# EAGLE design cft-memory-board (EAGLE 5.11)
DRAWN_BY: Alexios; PROJECT_NAME: CFT Mini-Computer; REVISION: Rev A; SHEET_DESCRIPTION: Memory (up to 512kW RAM, 512kW ROM); SIMULATION_FILENAME: memory.v#memory; URL: http://www.bedroomlan.org/cft

## Sheet 1 of 3
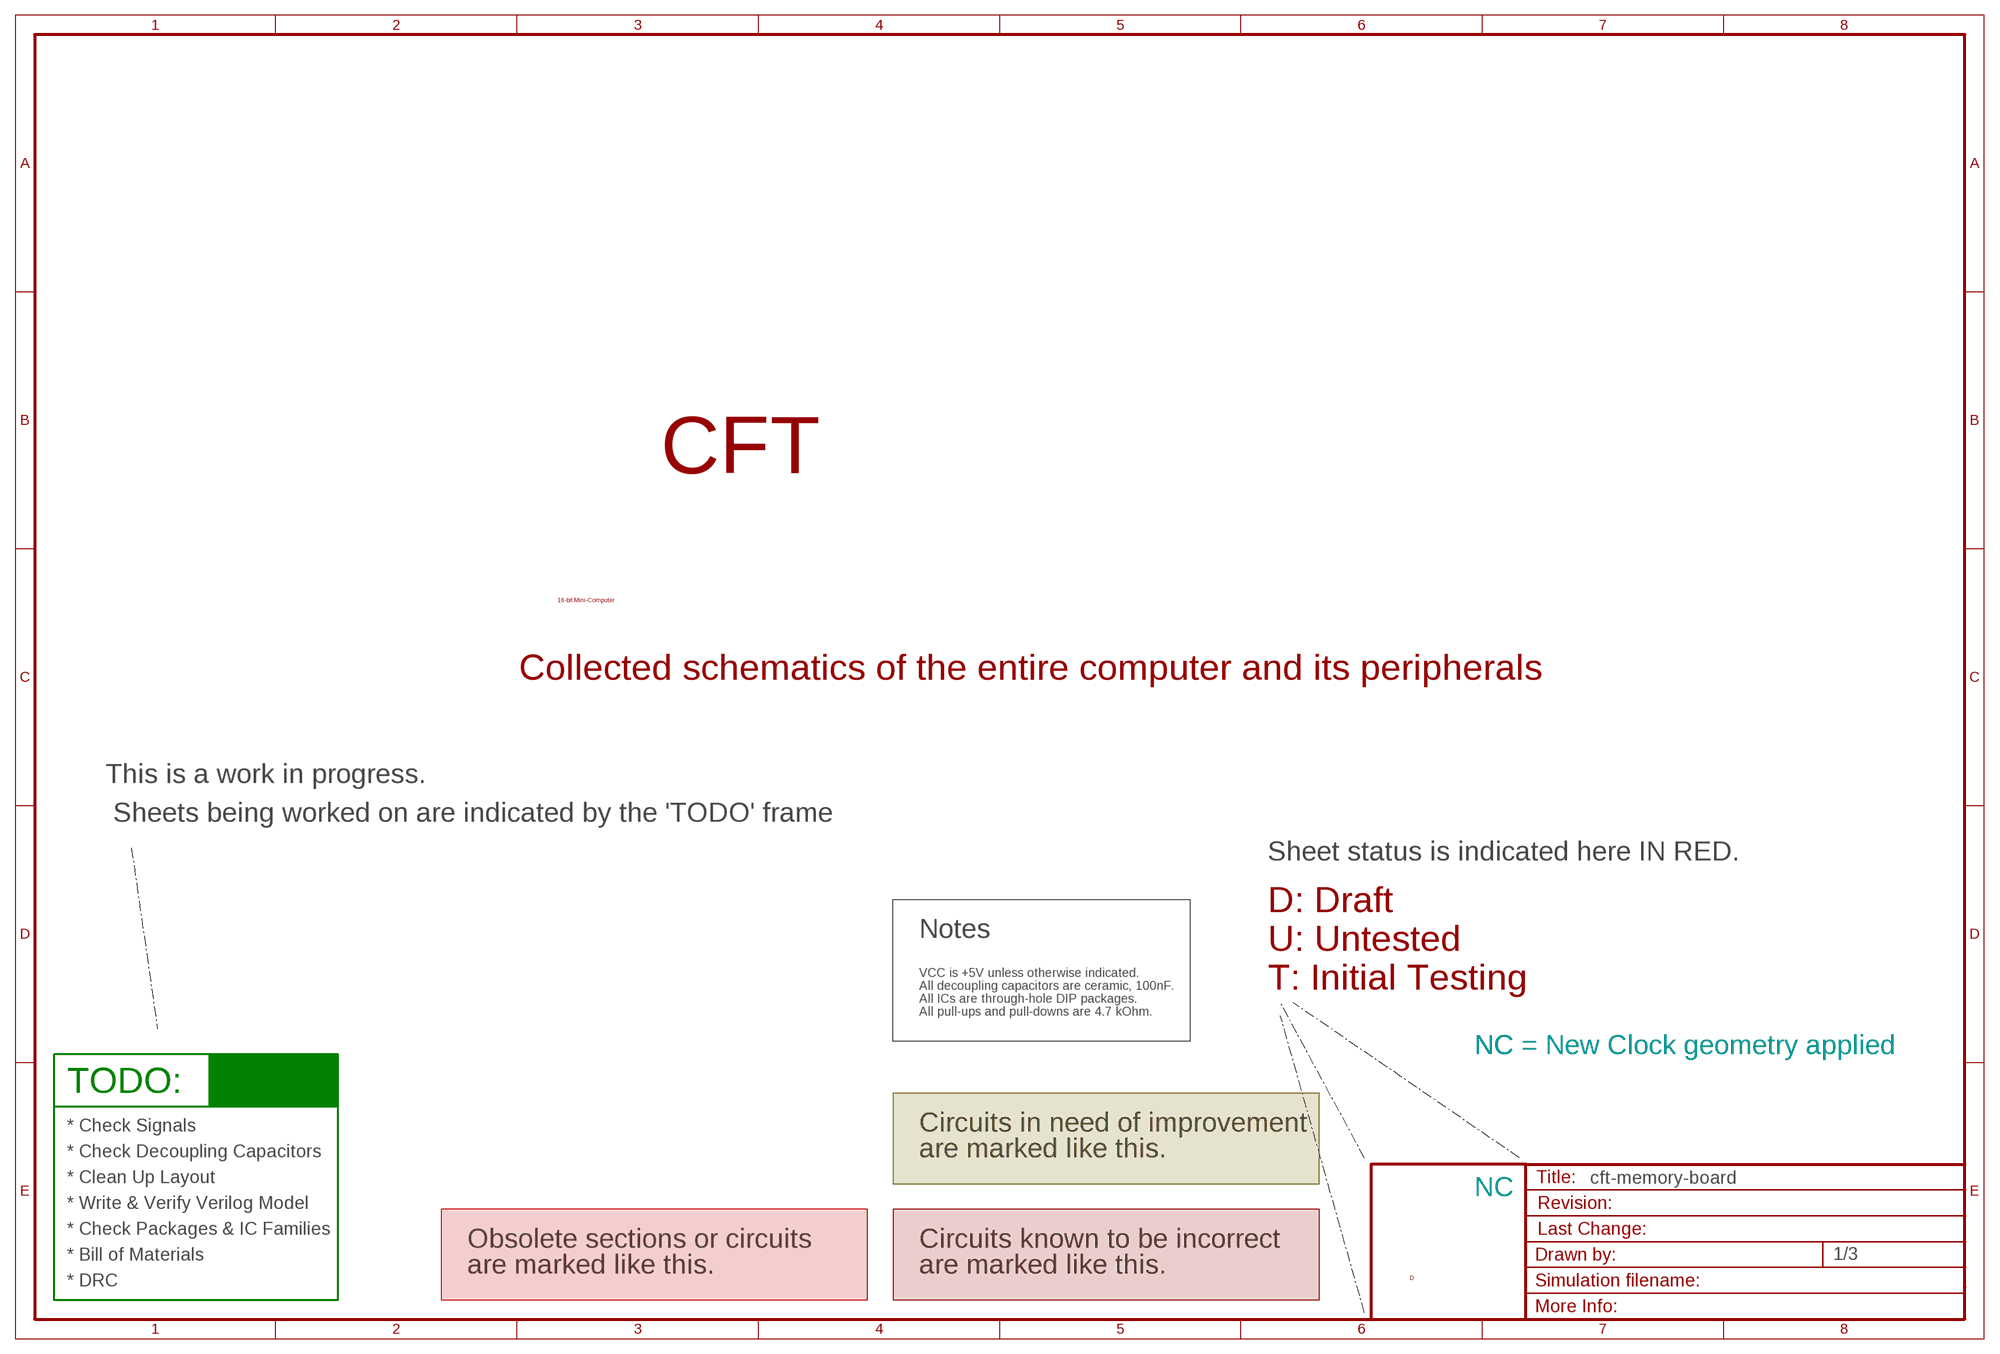
[diagram p0: schematic, sheet 1]

### Notes on the sheet
- CFT
- 16-bit Mini-Computer
- Collected schematics of the entire computer and its peripherals
- This is a work in progress.
- Sheets being worked on are indicated by the 'TODO' frame
- Sheet status is indicated here IN RED.
- D: Draft
- Notes
- U: Untested
- VCC is +5V unless otherwise indicated.
- All decoupling capacitors are ceramic, 100nF. | T: Initial Testing
- All ICs are through-hole DIP packages.
- All pull-ups and pull-downs are 4.7 kOhm.
- NC | NC = New Clock geometry applied
- TODO:
- * Check Signals | Circuits in need of improvement
- * Check Decoupling Capacitors | are marked like this.
- * Clean Up Layout
- NC
- * Write & Verify Verilog Model
- * Check Packages & IC Families
- Obsolete sections or circuits | Circuits known to be incorrect
- * Bill of Materials
- are marked like this. | are marked like this.
- D
- * DRC

## Sheet 2 of 3
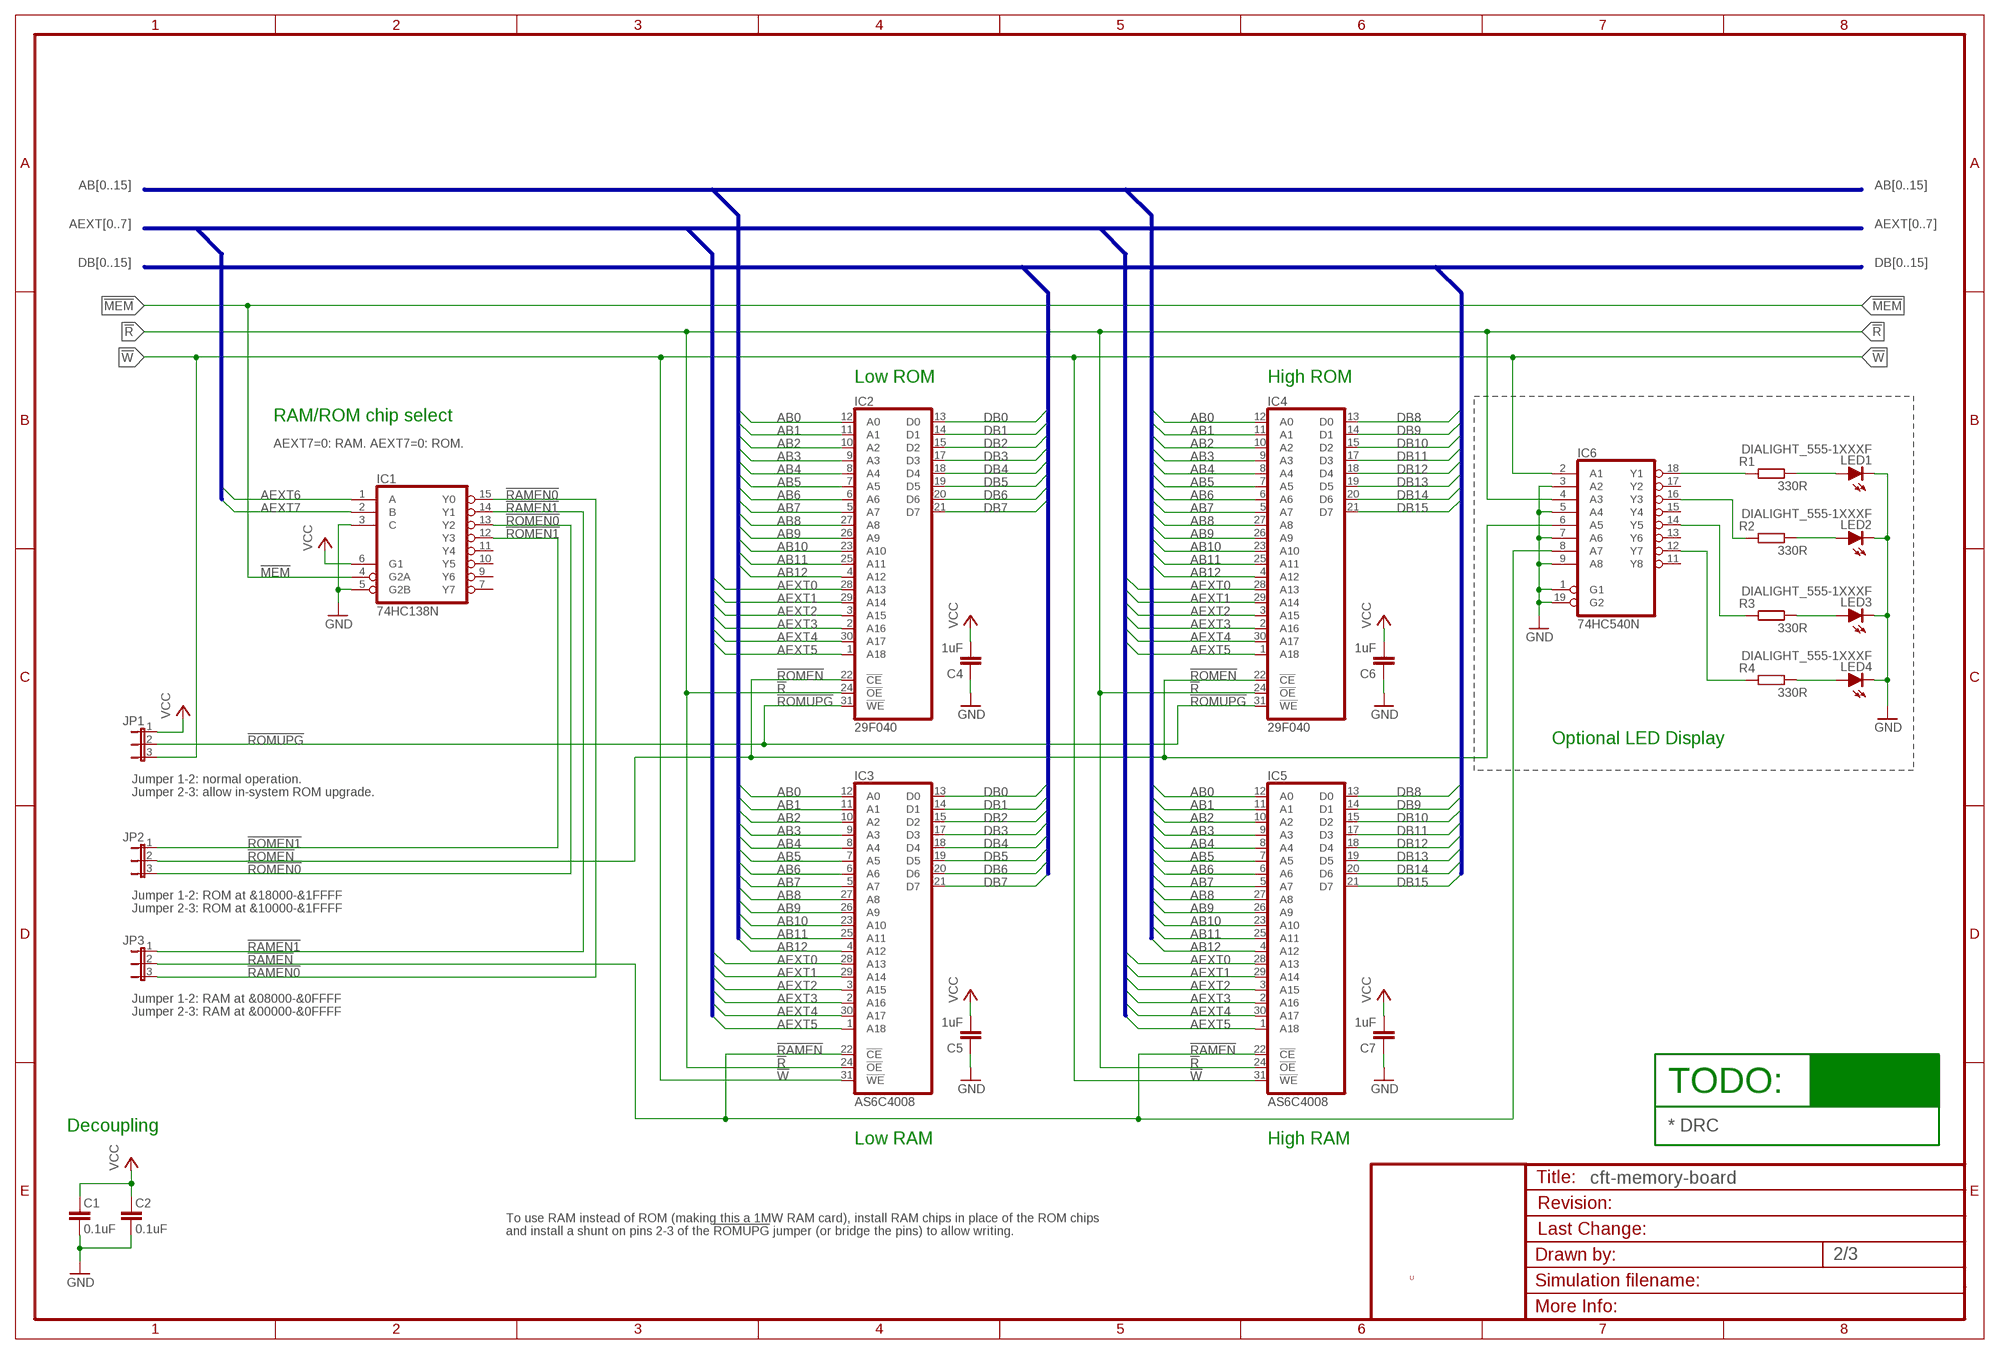
[diagram p1: schematic, sheet 2]

### Parts
C1  0.1uF  C-EU025-024X044  [C025-024X044]
C2  0.1uF  C-EU025-024X044  [C025-024X044]
C4  1uF  C-EU025-024X044  [C025-024X044]
C5  1uF  C-EU025-024X044  [C025-024X044]
C6  1uF  C-EU025-024X044  [C025-024X044]
C7  1uF  C-EU025-024X044  [C025-024X044]
IC1  74HC138N  [DIL16]
IC2  29F040  29F040PLCC32  [PLCC32]
IC3  AS6C4008  29F040DIP32  [DIL32]
IC4  29F040  29F040PLCC32  [PLCC32]
IC5  AS6C4008  29F040DIP32  [DIL32]
IC6  74HC540N  [DIL20]
JP1  JP2E  [JP2]
JP2  JP2E  [JP2]
JP3  JP2E  [JP2]
LED1  DIALIGHT_555-1XXXF  [LED_PCB2]
LED2  DIALIGHT_555-1XXXF  [LED_PCB2]
LED3  DIALIGHT_555-1XXXF  [LED_PCB2]
LED4  DIALIGHT_555-1XXXF  [LED_PCB2]
R1  330R  R-EU_0204/7  [0204/7]
R2  330R  R-EU_0204/7  [0204/7]
R3  330R  R-EU_0204/7  [0204/7]
R4  330R  R-EU_0204/7  [0204/7]

### Nets
!MEM: IC1.4(G2A) ; also sheet 3
!R: IC2.24(!OE) IC3.24(!OE) IC4.24(!OE) IC5.24(!OE) IC6.4(A3) ; also sheet 3
!RAMEN: IC3.22(!CE) IC5.22(!CE) IC6.8(A7) JP3.2
!RAMEN0: IC1.15(Y0) JP3.3
!RAMEN1: IC1.14(Y1) JP3.1
!ROMEN: IC2.22(!CE) IC4.22(!CE) IC6.6(A5) JP2.2
!ROMEN0: IC1.13(Y2) JP2.3
!ROMEN1: IC1.12(Y3) JP2.1
!ROMUPG: IC2.31(!WE) IC4.31(!WE) JP1.2
!W: IC3.31(!WE) IC5.31(!WE) IC6.2(A1) JP1.3 ; also sheet 3
AB0: IC2.12(A0) IC3.12(A0) IC4.12(A0) IC5.12(A0) ; also sheet 3
AB1: IC2.11(A1) IC3.11(A1) IC4.11(A1) IC5.11(A1) ; also sheet 3
AB2: IC2.10(A2) IC3.10(A2) IC4.10(A2) IC5.10(A2) ; also sheet 3
AB3: IC2.9(A3) IC3.9(A3) IC4.9(A3) IC5.9(A3) ; also sheet 3
AB4: IC2.8(A4) IC3.8(A4) IC4.8(A4) IC5.8(A4) ; also sheet 3
AB5: IC2.7(A5) IC3.7(A5) IC4.7(A5) IC5.7(A5) ; also sheet 3
AB6: IC2.6(A6) IC3.6(A6) IC4.6(A6) IC5.6(A6) ; also sheet 3
AB7: IC2.5(A7) IC3.5(A7) IC4.5(A7) IC5.5(A7) ; also sheet 3
AB8: IC2.27(A8) IC3.27(A8) IC4.27(A8) IC5.27(A8) ; also sheet 3
AB9: IC2.26(A9) IC3.26(A9) IC4.26(A9) IC5.26(A9) ; also sheet 3
AB10: IC2.23(A10) IC3.23(A10) IC4.23(A10) IC5.23(A10) ; also sheet 3
AB11: IC2.25(A11) IC3.25(A11) IC4.25(A11) IC5.25(A11) ; also sheet 3
AB12: IC2.4(A12) IC3.4(A12) IC4.4(A12) IC5.4(A12) ; also sheet 3
AEXT0: IC2.28(A13) IC3.28(A13) IC4.28(A13) IC5.28(A13) ; also sheet 3
AEXT1: IC2.29(A14) IC3.29(A14) IC4.29(A14) IC5.29(A14) ; also sheet 3
AEXT2: IC2.3(A15) IC3.3(A15) IC4.3(A15) IC5.3(A15) ; also sheet 3
AEXT3: IC2.2(A16) IC3.2(A16) IC4.2(A16) IC5.2(A16) ; also sheet 3
AEXT4: IC2.30(A17) IC3.30(A17) IC4.30(A17) IC5.30(A17) ; also sheet 3
AEXT5: IC2.1(A18) IC3.1(A18) IC4.1(A18) IC5.1(A18) ; also sheet 3
AEXT6: IC1.1(A) ; also sheet 3
AEXT7: IC1.2(B) ; also sheet 3
DB0: IC2.13(D0) IC3.13(D0) ; also sheet 3
DB1: IC2.14(D1) IC3.14(D1) ; also sheet 3
DB2: IC2.15(D2) IC3.15(D2) ; also sheet 3
DB3: IC2.17(D3) IC3.17(D3) ; also sheet 3
DB4: IC2.18(D4) IC3.18(D4) ; also sheet 3
DB5: IC2.19(D5) IC3.19(D5) ; also sheet 3
DB6: IC2.20(D6) IC3.20(D6) ; also sheet 3
DB7: IC2.21(D7) IC3.21(D7) ; also sheet 3
DB8: IC4.13(D0) IC5.13(D0) ; also sheet 3
DB9: IC4.14(D1) IC5.14(D1) ; also sheet 3
DB10: IC4.15(D2) IC5.15(D2) ; also sheet 3
DB11: IC4.17(D3) IC5.17(D3) ; also sheet 3
DB12: IC4.18(D4) IC5.18(D4) ; also sheet 3
DB13: IC4.19(D5) IC5.19(D5) ; also sheet 3
DB14: IC4.20(D6) IC5.20(D6) ; also sheet 3
DB15: IC4.21(D7) IC5.21(D7) ; also sheet 3
GND [low power]: C1.1 C2.1 C4.1 C5.1 C6.1 C7.1 IC1.3(C) IC1.5(G2B) IC6.1(G1) IC6.3(A2) IC6.5(A4) IC6.7(A6) IC6.9(A8) IC6.19(G2) LED1.K(C) LED2.K(C) LED3.K(C) LED4.K(C) ; also sheet 3
N$104: LED1.A R1.2
N$136: IC6.18(Y1) R1.1
N$137: LED2.A R2.2
N$138: IC6.16(Y3) R2.1
N$139: LED3.A R3.2
N$140: IC6.14(Y5) R3.1
N$141: LED4.A R4.2
N$150: IC6.12(Y7) R4.1
VCC [low power]: C1.2 C2.2 C4.2 C5.2 C6.2 C7.2 IC1.6(G1) JP1.1 ; also sheet 3
Unconnected: IC1.7(Y7) IC1.9(Y6) IC1.10(Y5) IC1.11(Y4) IC6.11(Y8) IC6.13(Y6) IC6.15(Y4) IC6.17(Y2)

### Buses
AB[0..15]
DB[0..15]
AEXT[0..7]

### Notes on the sheet
- Low ROM | High ROM
- RAM/ROM chip select
- AEXT7=0: RAM. AEXT7=0: ROM.
- Optional LED Display
- Jumper 1-2: normal operation.
- Jumper 2-3: allow in-system ROM upgrade.
- Jumper 1-2: ROM at &18000-&1FFFF
- Jumper 2-3: ROM at &10000-&1FFFF
- Jumper 1-2: RAM at &08000-&0FFFF
- Jumper 2-3: RAM at &00000-&0FFFF
- TODO:
- Decoupling | * DRC
- Low RAM | High RAM
- To use RAM instead of ROM (making this a 1MW RAM card), install RAM chips in place of the ROM chips
- and install a shunt on pins 2-3 of the !ROMUPG! jumper (or bridge the pins) to allow writing.
- U

## Sheet 3 of 3
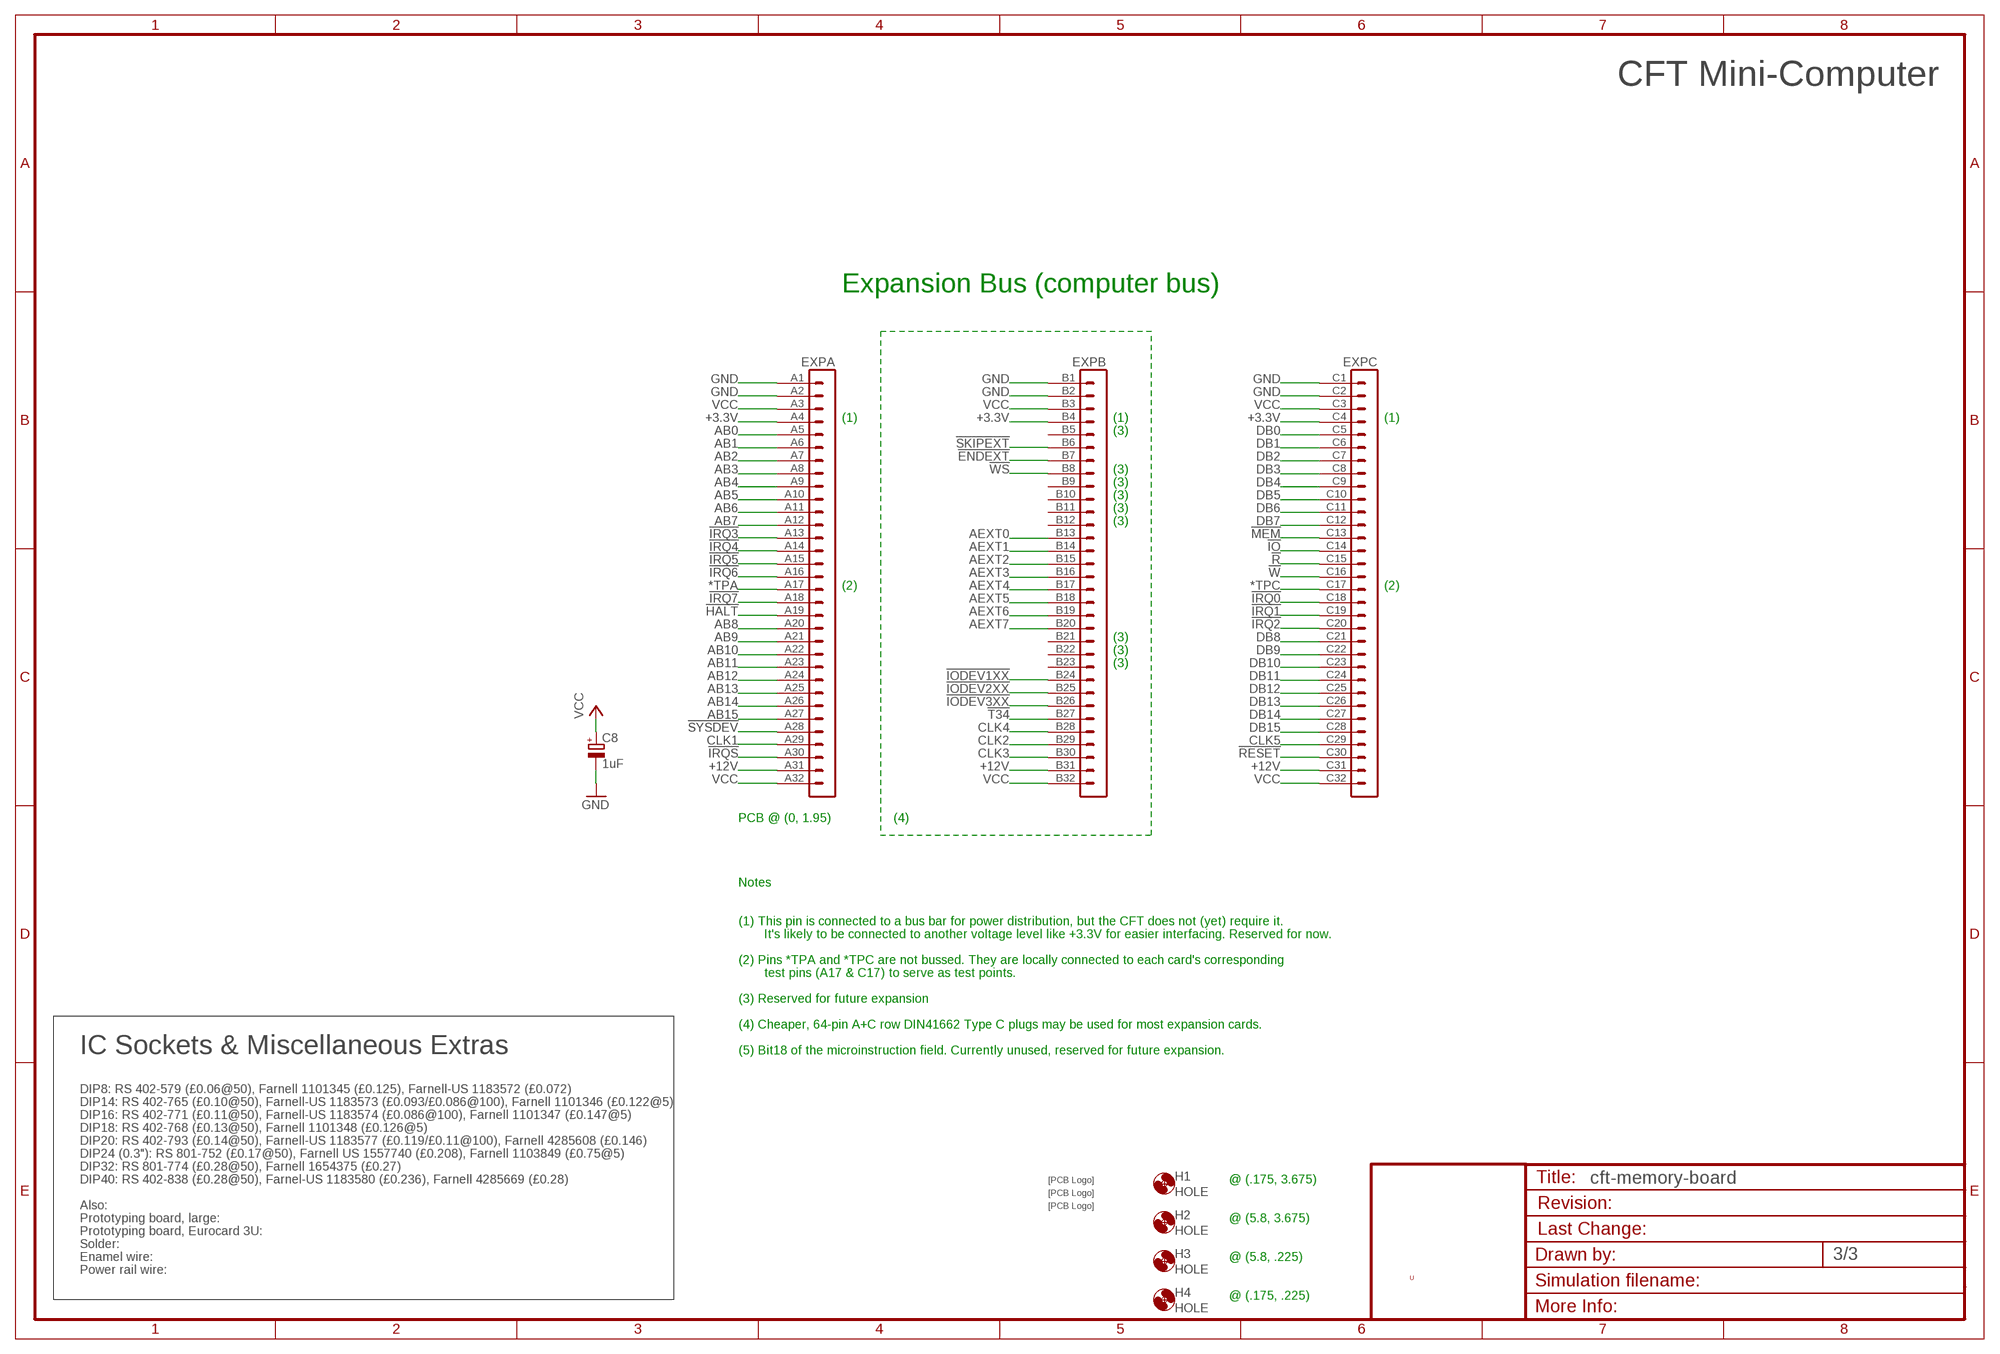
[diagram p2: schematic, sheet 3]

### Parts
C8  1uF  CPOL-EUE2.5-5  [E2,5-5]
EXP  VG96-3K  [VG96K]
H1  HOLE  [STANDOFF_28_60]
H2  HOLE  [STANDOFF_28_60]
H3  HOLE  [STANDOFF_28_60]
H4  HOLE  [STANDOFF_28_60]
U$1  SIGNATUREPLANE  [SIGNATURE_PLANE]
U$2  SIGNATUREPLANE  [SIGNATURE_PLANE]
U$3  SIGNATURESILK  [SIGNATURE]

### Nets
!ENDEXT: EXP.B7
!HALT: EXP.A19
!IO: EXP.C14
!IODEV1XX: EXP.B24
!IODEV2XX: EXP.B25
!IODEV3XX: EXP.B26
!IRQ0: EXP.C18
!IRQ1: EXP.C19
!IRQ2: EXP.C20
!IRQ3: EXP.A13
!IRQ4: EXP.A14
!IRQ5: EXP.A15
!IRQ6: EXP.A16
!IRQ7: EXP.A18
!IRQS: EXP.A30
!MEM: EXP.C13 ; also sheet 2
!R: EXP.C15 ; also sheet 2
!RESET: EXP.C30
!SKIPEXT: EXP.B6
!SYSDEV: EXP.A28
!T34: EXP.B27
!W: EXP.C16 ; also sheet 2
!WS: EXP.B8
*TPA: EXP.A17
*TPC: EXP.C17
+3.3V: EXP.A4 EXP.B4 EXP.C4
+12V [LED power]: EXP.A31 EXP.B31 EXP.C31
AB0: EXP.A5 ; also sheet 2
AB1: EXP.A6 ; also sheet 2
AB2: EXP.A7 ; also sheet 2
AB3: EXP.A8 ; also sheet 2
AB4: EXP.A9 ; also sheet 2
AB5: EXP.A10 ; also sheet 2
AB6: EXP.A11 ; also sheet 2
AB7: EXP.A12 ; also sheet 2
AB8: EXP.A20 ; also sheet 2
AB9: EXP.A21 ; also sheet 2
AB10: EXP.A22 ; also sheet 2
AB11: EXP.A23 ; also sheet 2
AB12: EXP.A24 ; also sheet 2
AB13: EXP.A25
AB14: EXP.A26
AB15: EXP.A27
AEXT0: EXP.B13 ; also sheet 2
AEXT1: EXP.B14 ; also sheet 2
AEXT2: EXP.B15 ; also sheet 2
AEXT3: EXP.B16 ; also sheet 2
AEXT4: EXP.B17 ; also sheet 2
AEXT5: EXP.B18 ; also sheet 2
AEXT6: EXP.B19 ; also sheet 2
AEXT7: EXP.B20 ; also sheet 2
CLK1: EXP.A29
CLK2: EXP.B29
CLK3: EXP.B30
CLK4: EXP.B28
CLK5: EXP.C29
DB0: EXP.C5 ; also sheet 2
DB1: EXP.C6 ; also sheet 2
DB2: EXP.C7 ; also sheet 2
DB3: EXP.C8 ; also sheet 2
DB4: EXP.C9 ; also sheet 2
DB5: EXP.C10 ; also sheet 2
DB6: EXP.C11 ; also sheet 2
DB7: EXP.C12 ; also sheet 2
DB8: EXP.C21 ; also sheet 2
DB9: EXP.C22 ; also sheet 2
DB10: EXP.C23 ; also sheet 2
DB11: EXP.C24 ; also sheet 2
DB12: EXP.C25 ; also sheet 2
DB13: EXP.C26 ; also sheet 2
DB14: EXP.C27 ; also sheet 2
DB15: EXP.C28 ; also sheet 2
GND [low power]: C8.- EXP.A1 EXP.A2 EXP.B1 EXP.B2 EXP.C1 EXP.C2 ; also sheet 2
VCC [low power]: C8.+ EXP.A3 EXP.A32 EXP.B3 EXP.B32 EXP.C3 EXP.C32 ; also sheet 2
Unconnected: EXP.B5 EXP.B9 EXP.B10 EXP.B11 EXP.B12 EXP.B21 EXP.B22 EXP.B23

### Notes on the sheet
- CFT Mini-Computer
- Expansion Bus (computer bus)
- (1) | (1) | (1)
- (3)
- (3)
- (3)
- (3)
- (3)
- (3)
- (2) | (2)
- (3)
- (3)
- (3)
- PCB @ (0, 1.95) | (4)
- Notes
- (1) This pin is connected to a bus bar for power distribution, but the CFT does not (yet) require it.
- It's likely to be connected to another voltage level like +3.3V for easier interfacing. Reserved for now.
- (2) Pins *TPA and *TPC are not bussed. They are locally connected to each card's corresponding
- test pins (A17 & C17) to serve as test points.
- (3) Reserved for future expansion
- (4) Cheaper, 64-pin A+C row DIN41662 Type C plugs may be used for most expansion cards.
- IC Sockets & Miscellaneous Extras | (5) Bit18 of the microinstruction field. Currently unused, reserved for future expansion.
- DIP8: RS 402-579 (£0.06@50), Farnell 1101345 (£0.125), Farnell-US 1183572 (£0.072)
- DIP14: RS 402-765 (£0.10@50), Farnell-US 1183573 (£0.093/£0.086@100), Farnell 1101346 (£0.122@5)
- DIP16: RS 402-771 (£0.11@50), Farnell-US 1183574 (£0.086@100), Farnell 1101347 (£0.147@5)
- DIP18: RS 402-768 (£0.13@50), Farnell 1101348 (£0.126@5)
- DIP20: RS 402-793 (£0.14@50), Farnell-US 1183577 (£0.119/£0.11@100), Farnell 4285608 (£0.146)
- DIP24 (0.3"): RS 801-752 (£0.17@50), Farnell US 1557740 (£0.208), Farnell 1103849 (£0.75@5)
- DIP32: RS 801-774 (£0.28@50), Farnell 1654375 (£0.27)
- DIP40: RS 402-838 (£0.28@50), Farnel-US 1183580 (£0.236), Farnell 4285669 (£0.28) | @ (.175, 3.675)
- Also:
- Prototyping board, large: | @ (5.8, 3.675)
- Prototyping board, Eurocard 3U:
- Solder:
- Enamel wire: | @ (5.8, .225)
- Power rail wire:
- U
- @ (.175, .225)

## Power pins joined to a net without a drawn wire
GND: IC1.8(GND) IC2.16(GND) IC3.16(GND) IC4.16(GND) IC5.16(GND) IC6.10(GND)
VCC: IC1.16(VCC) IC2.32(VCC) IC3.32(VCC) IC4.32(VCC) IC5.32(VCC) IC6.20(VCC)

## Library data of the parts
C1 C2 C4-C7 = rcl:C-EU: CAPACITOR, European symbol
C8 = rcl:CPOL-EU: POLARIZED CAPACITOR, European symbol
EXP = alexios-19inch:VG96-3: PCB EUROCARD, 96-pin type C/ABC, 2.54 mm
H1-H4 = alexios:HOLE: Hole for a standoff or mount. Hole diameter: 3.3mm. External Diameter: 6mm.
IC1 = alexios:74*138: 3-line to 8-line DECODER/DEMULTIPLEXER
IC2-IC5 = alexios:29F040: 4-mbit (512x8) Flash memory in a PLCC32 package (with socket). AM29F040 is an example of this.
IC6 = alexios:74*540: Octal BUFFER and LINE DRIVER, 3-state
JP1-JP3 = jumper:JP2E: JUMPER
LED1-LED4 = alexios:DIALIGHT_555-1XXXF: 3mm PCB LED. Farnell: description <http://uk.farnell.com/dialight/551-1307f/led-pcb-3mm-lc-green/dp/1306035>
R1-R4 = rcl:R-EU_: RESISTOR, European symbol
U$1-U$3 = alexios:SIGNATURE: Soup signature

## Net classes
0 default: width 0.305 mm, clearance 0.203 mm
1 low power: width 1.27 mm, clearance 0.254 mm
2 LED power: width 1.93 mm, clearance 0.254 mm

## Board
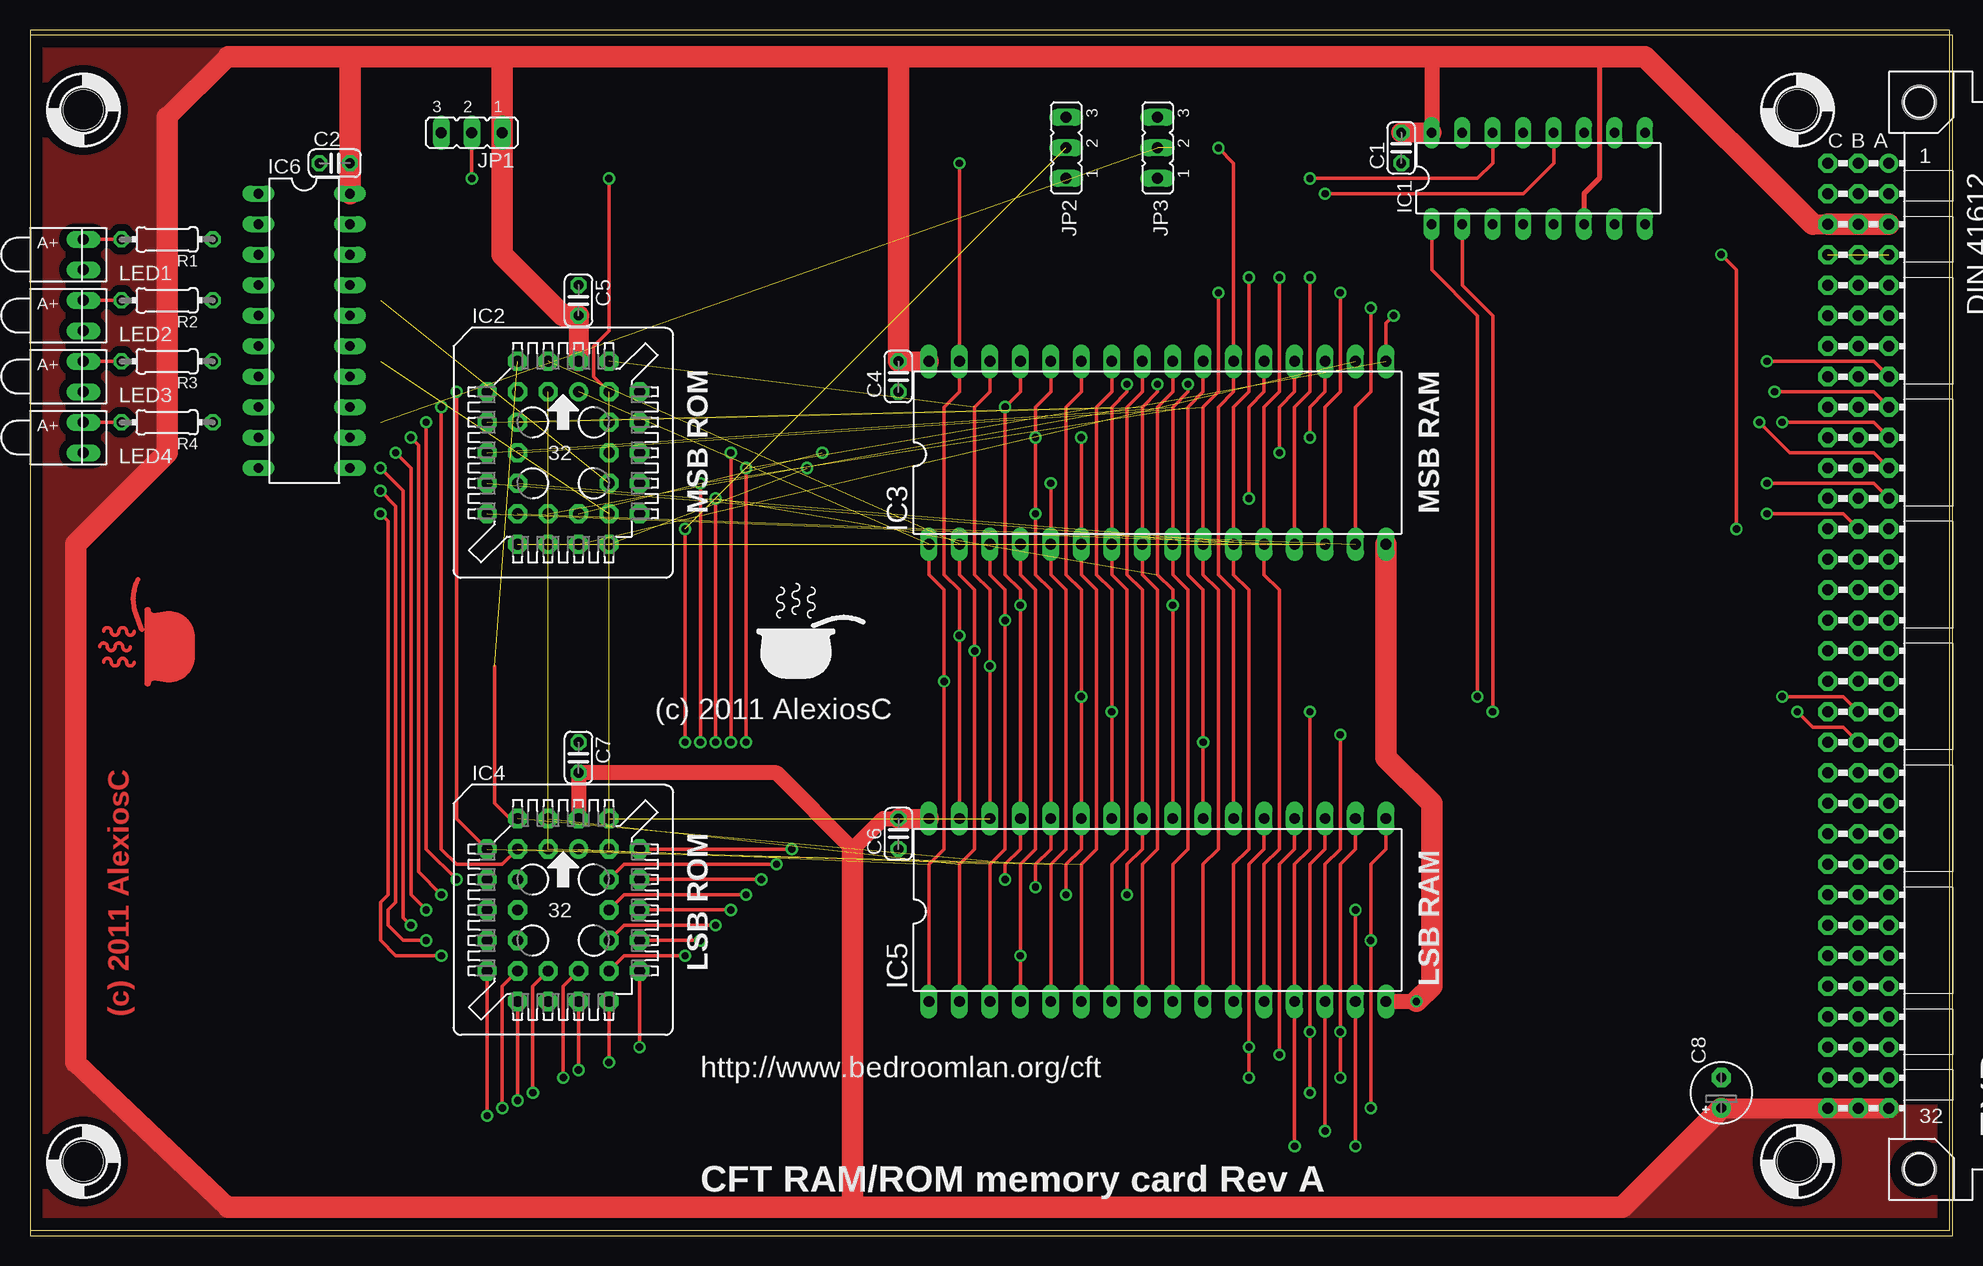
[diagram p3: board, top side]
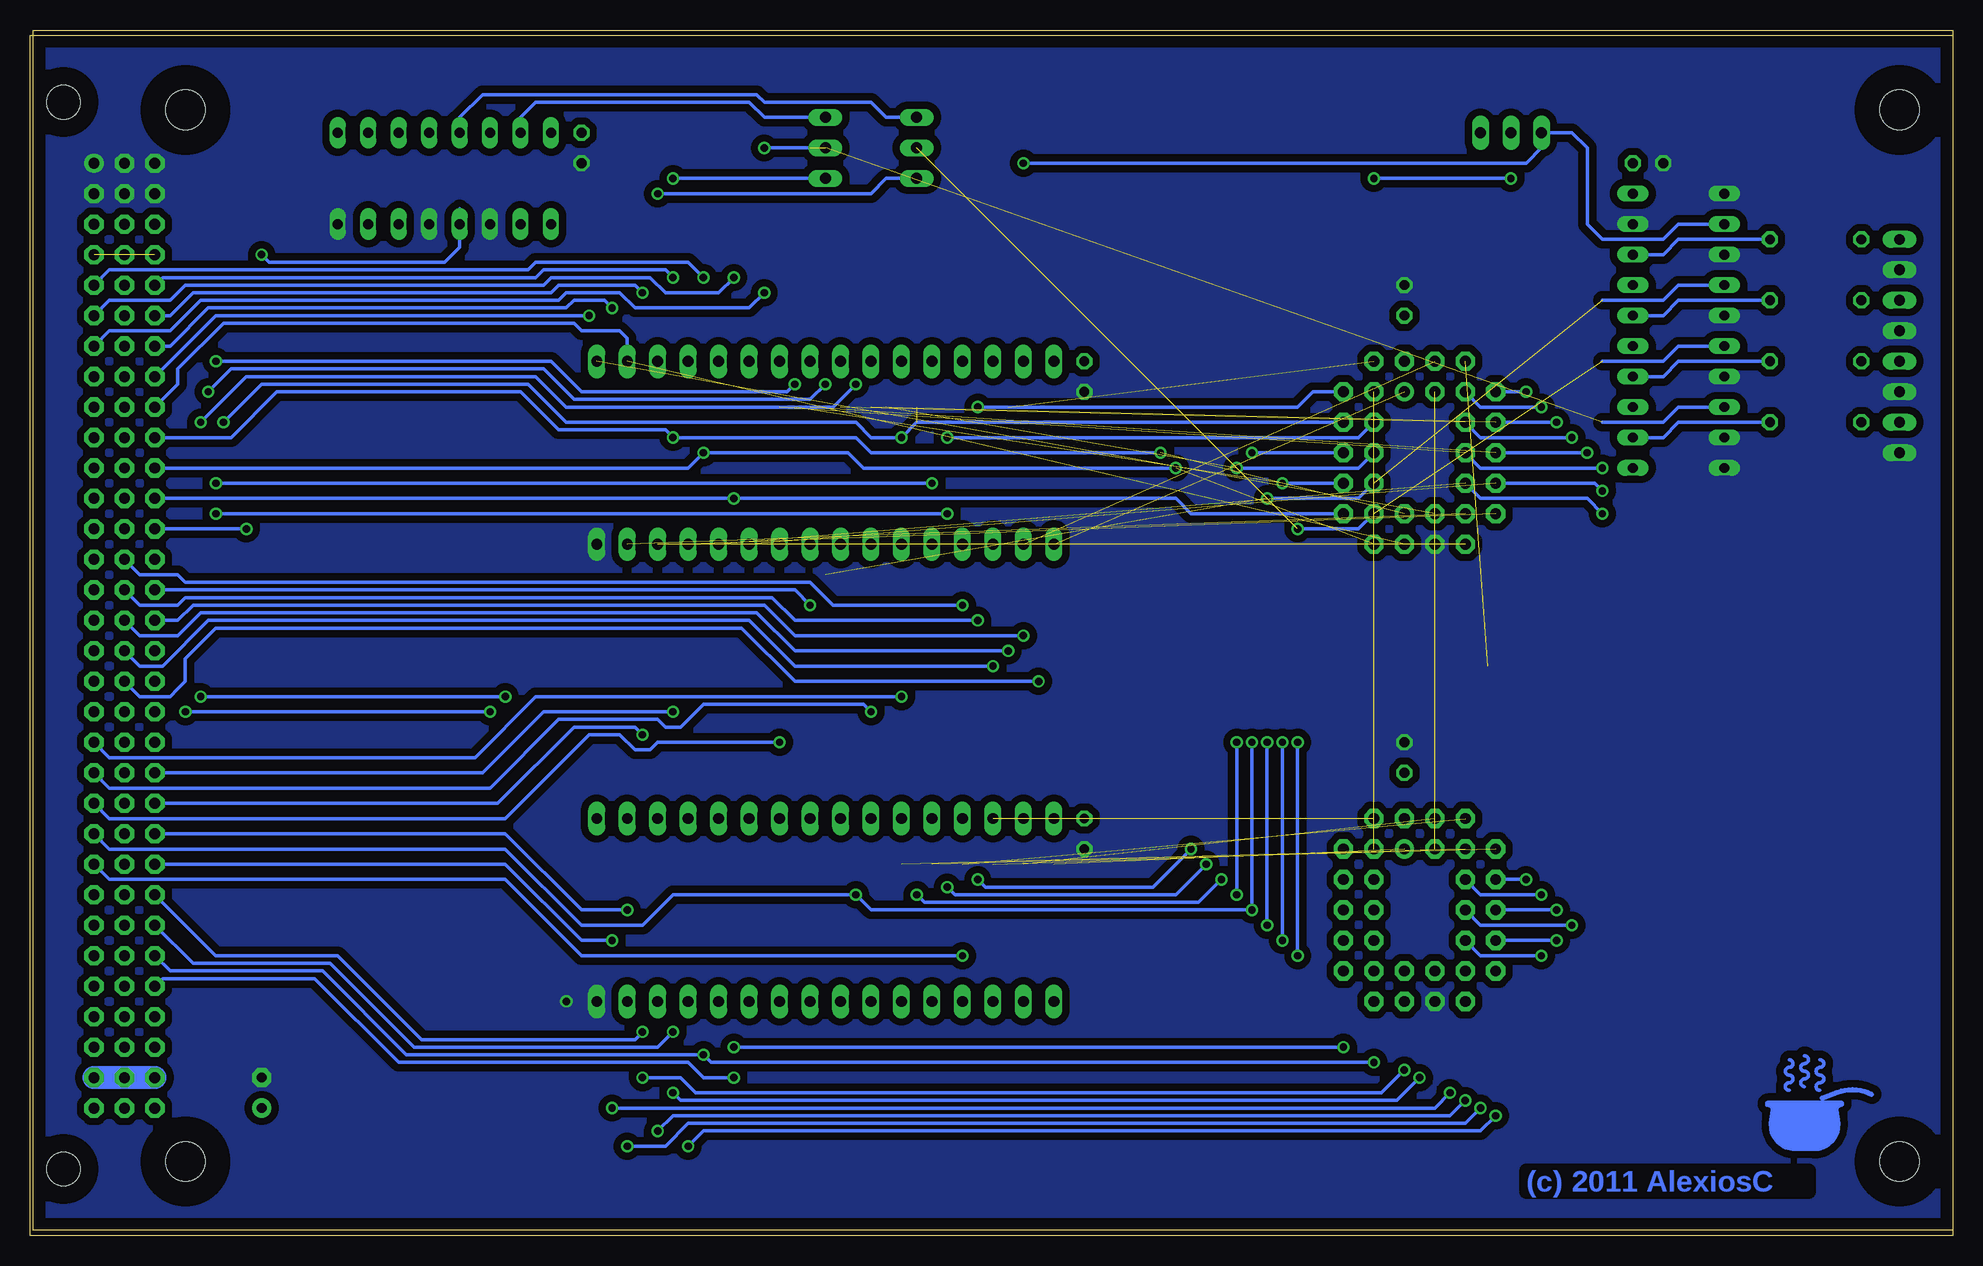
[diagram p4: board, bottom side, seen from below]

Size 160 x 100 mm. Coordinates in mm from the lower left corner, seen from the top.
Outline: 0,0 160,0 160,100 0,100 0,0
Copper layers (1*16): Top 0.035mm / dielectric 1.5mm / Bottom 0.035mm
Design rules "default": minimum track width 10mil, minimum drill 24mil, track to track 8mil, track to pad 8mil, pad to pad 8mil, via to via 8mil, smd to smd 8mil, copper to edge 40mil, drill to drill 8mil, minimum pad ring 10mil, minimum via ring 8mil, stop-mask expansion 4mil, vias tented up to drill 0mil, thermal gap 10mil

### Footprints (pad centres in the part's own frame; a part is rotated, then mirrored left to right if it is on the bottom)
C025-024X044 = drill 0.813 octagon: 1 -1.27,0; 2 1.27,0
E2,5-5 = drill 0.813 pad 1.6 round: + -1.27,0 | drill 0.813 pad 1.6 octagon: - 1.27,0
VG96K = drill 0.914 pad 1.6 round: A1 154.94,39.37 | drill 0.914 pad 1.6 octagon: A2 154.94,36.83; A3 154.94,34.29; A4 154.94,31.75; A5 154.94,29.21; A6 154.94,26.67; A7 154.94,24.13; A8 154.94,21.59; A9 154.94,19.05; A10 154.94,16.51; A11 154.94,13.97; A12 154.94,11.43; A13 154.94,8.89; A14 154.94,6.35; A15 154.94,3.81; A16 154.94,1.27; A17 154.94,-1.27; A18 154.94,-3.81; A19 154.94,-6.35; A20 154.94,-8.89; A21 154.94,-11.43; A22 154.94,-13.97; A23 154.94,-16.51; A24 154.94,-19.05; A25 154.94,-21.59; A26 154.94,-24.13; A27 154.94,-26.67; A28 154.94,-29.21; A29 154.94,-31.75; A30 154.94,-34.29; A31 154.94,-36.83; A32 154.94,-39.37; B1 152.4,39.37; B2 152.4,36.83; B3 152.4,34.29; B4 152.4,31.75; B5 152.4,29.21; B6 152.4,26.67; B7 152.4,24.13; B8 152.4,21.59; B9 152.4,19.05; B10 152.4,16.51; B11 152.4,13.97; B12 152.4,11.43; B13 152.4,8.89; B14 152.4,6.35; B15 152.4,3.81; B16 152.4,1.27; B17 152.4,-1.27; B18 152.4,-3.81; B19 152.4,-6.35; B20 152.4,-8.89; B21 152.4,-11.43; B22 152.4,-13.97; B23 152.4,-16.51; B24 152.4,-19.05; B25 152.4,-21.59; B26 152.4,-24.13; B27 152.4,-26.67; B28 152.4,-29.21; B29 152.4,-31.75; B30 152.4,-34.29; B31 152.4,-36.83; B32 152.4,-39.37; C1 149.86,39.37; C2 149.86,36.83; C3 149.86,34.29; C4 149.86,31.75; C5 149.86,29.21; C6 149.86,26.67; C7 149.86,24.13; C8 149.86,21.59; C9 149.86,19.05; C10 149.86,16.51; C11 149.86,13.97; C12 149.86,11.43; C13 149.86,8.89; C14 149.86,6.35; C15 149.86,3.81; C16 149.86,1.27; C17 149.86,-1.27; C18 149.86,-3.81; C19 149.86,-6.35; C20 149.86,-8.89; C21 149.86,-11.43; C22 149.86,-13.97; C23 149.86,-16.51; C24 149.86,-19.05; C25 149.86,-21.59; C26 149.86,-24.13; C27 149.86,-26.67; C28 149.86,-29.21; C29 149.86,-31.75; C30 149.86,-34.29; C31 149.86,-36.83; C32 149.86,-39.37 | hole 2.794: 157.48,44.45; 157.48,-44.45
STANDOFF_28_60 = hole 3.302: 0,0
DIL16 = drill 0.813 long: 1 -8.89,-3.81; 2 -6.35,-3.81; 3 -3.81,-3.81; 4 -1.27,-3.81; 5 1.27,-3.81; 6 3.81,-3.81; 7 6.35,-3.81; 8 8.89,-3.81; 9 8.89,3.81; 10 6.35,3.81; 11 3.81,3.81; 12 1.27,3.81; 13 -1.27,3.81; 14 -3.81,3.81; 15 -6.35,3.81; 16 -8.89,3.81
PLCC32 = drill 0.9 pad 1.6 round: 1 1.27,5.08 | drill 0.9 pad 1.6 octagon: 2 -1.27,7.62; 3 -1.27,5.08; 4 -3.81,7.62; 5 -6.35,5.08; 6 -3.81,5.08; 7 -6.35,2.54; 8 -3.81,2.54; 9 -6.35,0; 10 -3.81,0; 11 -6.35,-2.54; 12 -3.81,-2.54; 13 -6.35,-5.08; 14 -3.81,-7.62; 15 -3.81,-5.08; 16 -1.27,-7.62; 17 -1.27,-5.08; 18 1.27,-7.62; 19 1.27,-5.08; 20 3.81,-7.62; 21 6.35,-5.08; 22 3.81,-5.08; 23 6.35,-2.54; 24 3.81,-2.54; 25 6.35,0; 26 3.81,0; 27 6.35,2.54; 28 3.81,2.54; 29 6.35,5.08; 30 3.81,7.62; 31 3.81,5.08; 32 1.27,7.62
DIL32 = drill 0.9 long: 1 -19.05,-7.62; 2 -16.51,-7.62; 3 -13.97,-7.62; 4 -11.43,-7.62; 5 -8.89,-7.62; 6 -6.35,-7.62; 7 -3.81,-7.62; 8 -1.27,-7.62; 9 1.27,-7.62; 10 3.81,-7.62; 11 6.35,-7.62; 12 8.89,-7.62; 13 11.43,-7.62; 14 13.97,-7.62; 15 16.51,-7.62; 16 19.05,-7.62; 17 19.05,7.62; 18 16.51,7.62; 19 13.97,7.62; 20 11.43,7.62; 21 8.89,7.62; 22 6.35,7.62; 23 3.81,7.62; 24 1.27,7.62; 25 -1.27,7.62; 26 -3.81,7.62; 27 -6.35,7.62; 28 -8.89,7.62; 29 -11.43,7.62; 30 -13.97,7.62; 31 -16.51,7.62; 32 -19.05,7.62
DIL20 = drill 0.813 long: 1 -11.43,-3.81; 2 -8.89,-3.81; 3 -6.35,-3.81; 4 -3.81,-3.81; 5 -1.27,-3.81; 6 1.27,-3.81; 7 3.81,-3.81; 8 6.35,-3.81; 9 8.89,-3.81; 10 11.43,-3.81; 11 11.43,3.81; 12 8.89,3.81; 13 6.35,3.81; 14 3.81,3.81; 15 1.27,3.81; 16 -1.27,3.81; 17 -3.81,3.81; 18 -6.35,3.81; 19 -8.89,3.81; 20 -11.43,3.81
JP2 = drill 0.914 long: 1 -2.54,0; 2 0,0; 3 2.54,0
LED_PCB2 = drill 0.9 long: A 0,1.27; K 0,-1.27
0204/7 = drill 0.813 octagon: 1 -3.81,0; 2 3.81,0

### Placement (x,y rotation side)
C1  114.3,90.17 90 top
C2  25.4,88.9 0 top
C4  72.39,71.12 90 top
C5  45.72,77.47 270 top
C6  72.39,33.02 90 top
C7  45.72,39.37 270 top
C8  140.97,11.43 90 top
EXP  0,49.53 0 top
H1  4.45,93.34 0 top
H2  147.32,93.34 0 top
H3  147.32,5.71 0 top
H4  4.45,5.71 0 top
IC1  125.73,87.63 0 top
IC2  44.45,64.77 0 top
IC3  93.98,64.77 0 top
IC4  44.45,26.67 0 top
IC5  93.98,26.67 0 top
IC6  22.86,74.93 270 top
JP1  36.83,91.44 180 top
JP2  86.36,90.17 90 top
JP3  93.98,90.17 90 top
LED1  4.45,81.28 0 top
LED2  4.45,76.2 0 top
LED3  4.45,71.12 0 top
LED4  4.45,66.04 0 top
R1  11.43,82.55 180 top
R2  11.43,77.47 180 top
R3  11.43,72.39 180 top
R4  11.43,67.31 180 top
U$1  15.24,6.35 0 bottom
U$2  13.97,45.72 90 top
U$3  60.96,45.72 0 top

### Tracks (layer width: path | path; a pad name or v marks a point on that pad's centre or on a via)
!MEM  (via drill 0.61)
  Top 0.305: v142.24,58.42 142.24,80.01 v140.97,81.28
  Bottom 0.305: 124.46,85.09 IC1.4 124.46,81.92 125.73,80.64 140.34,80.64 v140.97,81.28 | v142.24,58.42 EXP.C13
!R  (via drill 0.61)  (2 unrouted)
  Top 0.305: IC5.24 v95.25,52.07 95.25,53.34 93.98,54.61 93.98,68.58 95.25,69.85 IC3.24 | IC4.24 49.53,25.4 v57.15,25.4 | v57.15,40.64 v57.15,60.96
  Bottom 0.305: IC6.4 22.86,78.74 24.13,77.47 29.21,77.47 | EXP.C15 96.52,53.34 v95.25,52.07 | v57.15,25.4 v57.15,40.64 | IC2.24 49.53,60.96 v57.15,60.96
!RAMEN  (via drill 0.61)  (2 unrouted)
  Top 0.305: IC5.22 100.33,53.34 99.06,54.61 99.06,68.58 100.33,69.85 IC3.22 100.33,88.9 v99.06,90.17
  Bottom 0.305: IC6.8 22.86,68.58 24.13,67.31 29.21,67.31 | v99.06,90.17 95.25,90.17
!RAMEN0
  Bottom 0.305: JP3.3 99.06,92.71 100.33,93.98 118.11,93.98 119.38,92.71 IC1.15
!RAMEN1  (via drill 0.61)
  Top 0.305: v106.68,87.63 120.65,87.63 121.92,88.9 IC1.14
  Bottom 0.305: JP3.1 v106.68,87.63
!ROMEN  (via drill 0.61)  (2 unrouted)
  Top 0.305: IC4.22 49.53,22.86 v54.61,22.86 | v54.61,40.64 v54.61,58.42
  Bottom 0.305: IC6.6 22.86,73.66 24.13,72.39 29.21,72.39 | v54.61,22.86 v54.61,40.64 | v54.61,58.42 49.53,58.42 IC2.22
!ROMEN0
  Bottom 0.305: JP2.3 88.9,92.71 90.17,93.98 99.06,93.98 99.69,94.61 122.56,94.61 124.46,92.71 IC1.13
!ROMEN1  (via drill 0.61)
  Top 0.305: IC1.12 127,88.9 124.46,86.36 v107.95,86.36
  Bottom 0.305: v107.95,86.36 90.17,86.36 88.9,87.63 JP2.1
!ROMUPG  (via drill 0.61)  (1 unrouted)
  Top 0.305: v36.83,87.63 JP1.2 | v48.26,87.63 48.26,74.93 46.99,73.66 46.99,71.12 IC2.31
  Bottom 0.305: v48.26,87.63 v36.83,87.63
!W  (via drill 0.61)
  Top 0.305: IC5.31 v77.47,49.53 77.47,53.34 76.2,54.61 76.2,68.58 77.47,69.85 IC3.31 v77.47,88.9
  Bottom 0.305: IC6.2 22.86,83.82 24.13,82.55 29.21,82.55 30.48,83.82 30.48,90.17 31.75,91.44 JP1.3 34.29,90.17 35.56,88.9 v77.47,88.9 | EXP.C16 147.96,50.8 146.69,52.07 99.06,52.07 98.42,51.44 97.79,50.8 96.52,49.53 v77.47,49.53
+3.3V  (2 unrouted)
+12V
  Bottom 1.93: EXP.C31 EXP.B31 EXP.A31
AB0  (via drill 0.61)  (1 unrouted)
  Top 0.305: IC5.12 102.87,30.48 104.14,31.75 104.14,53.34 102.87,54.61 IC3.12 102.87,68.58 104.14,69.85 v104.14,79.38 | v34.29,22.86 30.48,22.86 29.21,24.13 29.21,27.3 29.84,27.94 29.84,59.05 v29.21,59.69
  Bottom 0.305: v104.14,79.38 105.41,80.64 118.11,80.64 118.75,80.01 153.67,80.01 EXP.A5 | IC4.12 39.37,22.86 v34.29,22.86 | v29.21,59.69 30.48,60.96 39.37,60.96 IC2.12
AB1  (via drill 0.61)  (1 unrouted)
  Top 0.305: IC5.11 100.33,30.48 101.6,31.75 101.6,53.34 100.33,54.61 IC3.11 100.33,68.58 101.6,69.85 v101.6,79.38 | v33.02,24.13 31.11,24.13 29.84,25.4 29.84,26.67 30.48,27.3 30.48,60.33 v29.21,61.59
  Bottom 0.305: EXP.A6 153.67,77.47 148.59,77.47 147.32,78.74 117.47,78.74 116.84,79.38 108.58,79.38 107.31,78.11 102.87,78.11 v101.6,79.38 | v29.21,61.59 29.84,62.23 IC2.11 | v33.02,24.13 IC4.11
AB2  (via drill 0.61)  (1 unrouted)
  Top 0.305: IC5.10 97.79,30.48 99.06,31.75 99.06,53.34 97.79,54.61 IC3.10 97.79,68.58 99.06,69.85 v99.06,78.11 | v31.75,25.4 31.11,26.04 31.11,61.59 v29.21,63.5
  Bottom 0.305: EXP.A7 153.67,74.93 148.59,74.93 146.05,77.47 116.2,77.47 115.57,78.11 111.12,78.11 109.86,76.83 100.33,76.83 v99.06,78.11 | IC4.10 39.37,25.4 v31.75,25.4 | v29.21,63.5 39.37,63.5 IC2.10
AB3  (via drill 0.61)  (1 unrouted)
  Top 0.305: IC5.9 95.25,30.48 96.52,31.75 96.52,53.34 95.25,54.61 IC3.9 95.25,68.58 96.52,69.85 v96.52,70.48 | EXP.A8 153.67,72.39 v144.78,72.39 | v33.02,26.67 31.75,27.94 31.75,63.5 v30.48,64.77
  Bottom 0.305: v144.78,72.39 116.84,72.39 114.3,69.85 97.16,69.85 v96.52,70.48 | v33.02,26.67 IC4.9 | v30.48,64.77 IC2.9
AB4  (via drill 0.61)  (1 unrouted)
  Top 0.305: IC5.8 92.71,30.48 93.98,31.75 93.98,53.34 92.71,54.61 IC3.8 92.71,68.58 93.98,69.85 v93.98,70.48 | EXP.A9 153.67,69.85 v145.41,69.85 | v34.29,27.94 32.38,29.84 32.38,65.41 v31.75,66.04
  Bottom 0.305: v145.41,69.85 143.51,71.75 117.47,71.75 114.94,69.22 95.25,69.22 v93.98,70.48 | IC4.8 39.37,27.94 v34.29,27.94 | v31.75,66.04 39.37,66.04 IC2.8
AB5  (via drill 0.61)  (1 unrouted)
  Top 0.305: IC5.7 90.17,30.48 91.44,31.75 91.44,53.34 90.17,54.61 IC3.7 90.17,68.58 91.44,69.85 v91.44,70.48 | EXP.A10 153.67,67.31 v146.05,67.31 | v35.56,29.21 33.02,31.75 v33.02,67.31
  Bottom 0.305: v91.44,70.48 93.34,68.58 115.57,68.58 118.11,71.12 142.24,71.12 v146.05,67.31 | v35.56,29.21 IC4.7 | v33.02,67.31 IC2.7
AB6  (via drill 0.61)  (1 unrouted)
  Top 0.305: IC5.6 87.63,30.48 88.9,31.75 88.9,53.34 87.63,54.61 IC3.6 v87.63,66.04 | EXP.A11 153.67,64.77 146.69,64.77 v144.15,67.31 | v34.29,68.58 34.29,31.75 35.56,30.48 39.37,30.48 IC4.6
  Bottom 0.305: v144.15,67.31 140.97,70.48 118.75,70.48 115.57,67.31 91.44,67.31 90.17,66.04 v87.63,66.04 | IC2.6 39.37,68.58 v34.29,68.58
AB7  (via drill 0.61)  (1 unrouted)
  Top 0.305: IC5.5 85.09,30.48 86.36,31.75 86.36,53.34 85.09,54.61 IC3.5 v85.09,62.23 | EXP.A12 153.67,62.23 v144.78,62.23 | IC4.5 35.56,34.29 v35.56,69.85
  Bottom 0.305: v85.09,62.23 v144.78,62.23 | v35.56,69.85 IC2.5
AB8  (via drill 0.61)  (1 unrouted)
  Top 0.305: IC3.27 87.63,69.85 86.36,68.58 86.36,54.61 87.63,53.34 v87.63,44.45 IC5.27 87.63,31.75 86.36,30.48 v86.36,27.94 | IC4.27 v60.96,29.21
  Bottom 0.305: EXP.A20 153.67,39.37 123.19,39.37 118.11,44.45 v87.63,44.45 | IC2.27 86.36,67.31 87.63,66.04 | v60.96,29.21 62.87,27.3 85.72,27.3 v86.36,27.94
AB9  (via drill 0.61)  (1 unrouted)
  Top 0.305: IC5.26 v90.17,43.18 90.17,53.34 88.9,54.61 88.9,68.58 90.17,69.85 IC3.26 | IC4.26 49.53,27.94 v59.69,27.94 | v59.69,40.64 v59.69,63.5
  Bottom 0.305: EXP.A21 153.67,36.83 121.92,36.83 116.2,42.55 107.95,42.55 107.31,41.91 106.05,41.91 104.14,43.81 90.81,43.81 v90.17,43.18 | v59.69,27.94 v59.69,40.64 | IC2.26 49.53,63.5 v59.69,63.5
AB10  (via drill 0.61)  (1 unrouted)
  Top 0.305: IC5.23 v97.79,40.64 97.79,53.34 96.52,54.61 96.52,68.58 97.79,69.85 IC3.23 | IC4.23 v55.88,24.13 | v55.88,40.64 v55.88,62.23
  Bottom 0.305: EXP.A22 153.67,34.29 120.65,34.29 113.67,41.27 111.12,41.27 109.86,40.01 108.58,40.01 107.95,40.64 v97.79,40.64 | v55.88,24.13 v55.88,40.64 | v55.88,62.23 IC2.23
AB11  (via drill 0.61)
  Top 0.305: IC3.25 92.71,69.85 91.44,68.58 91.44,54.61 92.71,53.34 IC5.25 92.71,31.75 91.44,30.48 v91.44,27.94 | IC4.25 v58.42,26.67 | v58.42,40.64 v58.42,64.77
  Bottom 0.305: EXP.A23 153.67,31.75 120.65,31.75 114.3,25.4 109.22,25.4 106.68,27.94 v91.44,27.94 90.17,26.67 v58.42,26.67 v58.42,40.64 | v58.42,64.77 IC2.25
AB12  (via drill 0.61)  (2 unrouted)
  Top 0.305: IC5.4 v82.55,22.86 82.55,30.48 83.82,31.75 83.82,53.34 82.55,54.61 IC3.4 | IC4.4 40.01,34.29 38.73,35.56 38.73,46.99
  Bottom 0.305: EXP.A24 153.67,29.21 120.65,29.21 114.3,22.86 v82.55,22.86
AEXT0  (via drill 0.61)
  Top 0.305: IC3.28 85.09,69.85 83.82,68.58 v83.82,66.04 v83.82,59.69 83.82,54.61 85.09,53.34 IC5.28 85.09,31.75 83.82,30.48 v83.82,28.57 | EXP.B13 151.13,59.69 v144.78,59.69 | IC4.28 49.53,30.48 v62.23,30.48
  Bottom 0.305: v83.82,59.69 v144.78,59.69 | v62.23,30.48 64.77,27.94 83.19,27.94 v83.82,28.57 | IC2.28 49.53,66.04 v83.82,66.04
AEXT1  (via drill 0.61)
  Top 0.305: IC3.29 82.55,69.85 v81.28,68.58 81.28,54.61 82.55,53.34 v82.55,52.07 IC5.29 82.55,31.75 81.28,30.48 v81.28,29.21 | IC4.29 v63.5,31.75
  Bottom 0.305: EXP.B14 151.13,54.61 147.96,54.61 147.32,53.98 95.25,53.98 93.34,52.07 v82.55,52.07 | IC2.29 53.34,69.85 54.61,68.58 v81.28,68.58 | v63.5,31.75 66.67,28.57 80.64,28.57 v81.28,29.21
AEXT2  (via drill 0.61)  (2 unrouted)
  Top 0.305: IC5.3 80.01,30.48 81.28,31.75 v81.28,50.8 81.28,53.34 80.01,54.61 IC3.3
  Bottom 0.305: EXP.B15 151.13,52.07 147.96,52.07 147.32,52.7 98.42,52.7 96.52,50.8 v81.28,50.8
AEXT3  (via drill 0.61)  (2 unrouted)
  Top 0.305: IC5.2 77.47,30.48 78.74,31.75 v78.74,48.26 78.74,53.34 77.47,54.61 IC3.2
  Bottom 0.305: EXP.B16 151.13,49.53 147.96,49.53 146.05,51.44 99.69,51.44 96.52,48.26 v78.74,48.26
AEXT4  (via drill 0.61)  (2 unrouted)
  Top 0.305: IC5.30 v80.01,46.99 80.01,53.34 78.74,54.61 78.74,68.58 80.01,69.85 IC3.30
  Bottom 0.305: EXP.B17 151.13,46.99 149.22,46.99 145.41,50.8 100.33,50.8 96.52,46.99 v80.01,46.99
AEXT5  (via drill 0.61)  (2 unrouted)
  Top 0.305: IC5.1 74.93,30.48 76.2,31.75 v76.2,45.72 76.2,53.34 74.93,54.61 IC3.1
  Bottom 0.305: EXP.B18 151.13,44.45 148.59,44.45 147.96,45.09 147.32,45.72 147.32,47.62 144.78,50.16 100.97,50.16 96.52,45.72 v76.2,45.72
AEXT6  (via drill 0.61)
  Top 0.305: EXP.B19 151.13,44.45 v146.05,44.45 | v120.65,44.45 120.65,76.2 116.84,80.01 IC1.1
  Bottom 0.305: v120.65,44.45 v146.05,44.45
AEXT7  (via drill 0.61)
  Top 0.305: IC1.2 119.38,78.74 121.92,76.2 v121.92,43.18 | v147.32,43.18 148.59,41.91 151.13,41.91 EXP.B20
  Bottom 0.305: v121.92,43.18 v147.32,43.18
DB0  (via drill 0.61)  (1 unrouted)
  Top 0.305: v106.68,79.38 106.68,69.85 105.41,68.58 IC3.13
  Bottom 0.305: v106.68,79.38 107.31,80.01 117.47,80.01 118.11,79.38 149.22,79.38 EXP.C5
DB1  (via drill 0.61)  (1 unrouted)
  Top 0.305: v109.22,78.11 109.22,69.85 107.95,68.58 IC3.14
  Bottom 0.305: v109.22,78.11 109.86,78.74 116.2,78.74 116.84,78.11 146.69,78.11 148.59,76.2 EXP.C6
DB2  (via drill 0.61)  (1 unrouted)
  Top 0.305: v111.76,76.83 111.76,69.85 110.49,68.58 IC3.15
  Bottom 0.305: EXP.C7 148.59,73.66 145.41,76.83 115.57,76.83 114.94,77.47 112.39,77.47 v111.76,76.83
DB3  (via drill 0.61)  (1 unrouted)
  Top 0.305: v113.67,76.2 113.03,75.56 IC3.17
  Bottom 0.305: EXP.C8 144.78,76.2 v113.67,76.2
DB4  (1 unrouted)
  Bottom 0.305: EXP.C9 147.96,70.48 147.96,71.75 144.15,75.56 114.94,75.56 114.3,74.93 111.12,74.93 110.49,74.3 IC3.18
DB5  (via drill 0.61)  (1 unrouted)
  Top 0.305: v106.68,66.04 106.68,68.58 107.95,69.85 IC3.19
  Bottom 0.305: EXP.C10 143.51,66.04 139.7,69.85 119.38,69.85 116.2,66.67 107.31,66.67 v106.68,66.04 91.44,66.04 90.17,64.77 v66.04,64.77
DB6  (via drill 0.61)  (1 unrouted)
  Top 0.305: v104.14,64.77 104.14,68.58 105.41,69.85 IC3.20
  Bottom 0.305: EXP.C11 105.41,63.5 v104.14,64.77 92.08,64.77 90.81,63.5 v64.77,63.5
DB7  (via drill 0.61)
  Top 0.305: v101.6,60.96 101.6,68.58 102.87,69.85 IC3.21
  Bottom 0.305: EXP.C12 v101.6,60.96 64.77,60.96 63.5,59.69 IC2.21
DB8  (via drill 0.61)
  Top 0.305: v105.41,6.99 IC5.13 105.41,30.48 106.68,31.75 v106.68,43.18 | v38.1,9.53 IC4.13
  Bottom 0.305: v105.41,6.99 104.14,8.26 39.37,8.26 v38.1,9.53 | v106.68,43.18 117.47,43.18 122.56,38.1 EXP.C21
DB9  (via drill 0.61)
  Top 0.305: v107.95,8.26 IC5.14 107.95,30.48 109.22,31.75 v109.22,41.27 | v40.64,10.79 IC4.14
  Bottom 0.305: EXP.C22 121.28,35.56 114.94,41.91 109.86,41.91 v109.22,41.27 | v40.64,10.79 41.91,9.53 106.68,9.53 v107.95,8.26
DB10  (via drill 0.61)
  Top 0.305: v110.49,26.67 IC5.15 v110.49,6.99 | IC4.15 39.37,20.32 v39.37,10.16
  Bottom 0.305: v110.49,26.67 114.3,26.67 120.65,33.02 EXP.C23 | v39.37,10.16 40.64,8.89 105.41,8.89 107.31,6.99 v110.49,6.99
DB11  (via drill 0.61)
  Top 0.305: IC5.17 113.03,31.75 111.76,30.48 v111.76,24.13 v111.76,10.16 | IC4.17 41.91,20.32 v41.91,11.43
  Bottom 0.305: EXP.C24 120.65,30.48 114.3,24.13 v111.76,24.13 | v41.91,11.43 43.18,10.16 v111.76,10.16
DB12  (via drill 0.61)
  Top 0.305: IC5.18 110.49,31.75 109.22,30.48 v109.22,16.51 v109.22,12.7 | v45.72,13.34 IC4.18
  Bottom 0.305: EXP.C25 144.78,22.86 134.62,22.86 127.64,15.88 109.86,15.88 v109.22,16.51 | v45.72,13.34 47.62,11.43 104.78,11.43 106.05,12.7 v109.22,12.7
DB13  (via drill 0.61)
  Top 0.305: IC5.19 107.95,31.75 106.68,30.48 v106.68,16.51 v106.68,11.43 | IC4.19 44.45,20.32 v44.45,12.7
  Bottom 0.305: EXP.C26 146.69,22.23 135.25,22.23 128.27,15.24 107.95,15.24 v106.68,16.51 | v44.45,12.7 46.35,10.79 106.05,10.79 v106.68,11.43
DB14  (via drill 0.61)
  Top 0.305: v104.14,14.61 104.14,30.48 105.41,31.75 IC5.20 | v48.26,13.97 IC4.20
  Bottom 0.305: EXP.C27 148.59,21.59 135.89,21.59 128.91,14.61 v104.14,14.61 103.5,13.97 v48.26,13.97
DB15  (via drill 0.61)
  Top 0.305: v101.6,12.7 v101.6,15.24 101.6,30.48 102.87,31.75 IC5.21 | v50.8,15.24 IC4.21
  Bottom 0.305: EXP.C28 149.22,20.95 136.53,20.95 129.54,13.97 105.41,13.97 104.14,12.7 v101.6,12.7 | v50.8,15.24 v101.6,15.24
GND  (via drill 0.61)
  Top 1.27: IC5.16 v115.57,19.05
  Top 1.778: IC3.16 113.03,39.37 116.84,35.56 116.84,20.32 v115.57,19.05
  pour Bottom (isolate 0.61, no thermals): 0,100.33 160.02,100.33 160.02,0 0,0
N$104
  Top 0.305: LED1.A R1.2
N$136
  Bottom 0.305: R1.1 22.86,82.55 24.13,81.28 IC6.18
N$137
  Top 0.305: LED2.A R2.2
N$138
  Bottom 0.305: R2.1 22.86,77.47 24.13,76.2 IC6.16
N$139
  Top 0.305: LED3.A R3.2
N$140
  Bottom 0.305: R3.1 22.86,72.39 24.13,71.12 IC6.14
N$141
  Top 0.305: LED4.A R4.2
N$150
  Bottom 0.305: R4.1 22.86,67.31 24.13,66.04 IC6.12
VCC
  Top 0.406: IC1.6 129.54,86.36 130.81,87.63 130.81,97.79
  Top 1.27: 116.84,97.79 IC1.16 | C6.2 71.12,34.29 68.58,31.75 62.23,38.1 C7.2 IC4.32
  Top 1.676: C8.+ EXP.C32 EXP.B32 EXP.A32 | C6.2 IC5.32 | C5.2 IC2.32 | IC1.16 C1.2 | C4.2 IC3.32 | 148.59,83.82 EXP.C3 | 11.43,92.71 16.51,97.79 | 16.51,1.91 3.81,13.97
  Top 1.778: EXP.C3 EXP.B3 EXP.A3 | IC6.20 C2.2 26.67,97.79 | 148.59,83.82 134.62,97.79 130.81,97.79 116.84,97.79 72.39,97.79 | 16.51,97.79 26.67,97.79 | 26.67,97.79 39.37,97.79 | 39.37,97.79 72.39,97.79 | 3.81,13.97 3.81,57.15 11.43,64.77 11.43,92.71 | 16.51,1.91 68.58,1.91 | 68.58,1.91 132.72,1.91 C8.+ | 39.37,97.79 JP1.1 39.37,81.28 44.45,76.2 C5.2 | 68.58,1.91 68.58,31.75 | 72.39,97.79 C4.2
  pour Top (isolate 0.61): 0,99.69 0,0 17.78,0 3.81,13.97 3.81,57.15 11.43,64.77 11.43,92.71 16.51,97.79 16.51,99.69
  pour Top (isolate 0.61, no thermals): 160.02,0 160.02,10.16 140.97,10.16 130.81,0

### Text on the board
Top: (c) 2011 AlexiosC
Bottom: (c) 2011 AlexiosC
tNames: MSB ROM | MSB RAM | (c) 2011 AlexiosC | LSB ROM | LSB RAM | http://www.bedroomlan.org/cft | CFT RAM/ROM memory card Rev A